# Altium schematic sheet LEDFLASHER_RC.SchDoc
size A; SheetNumber: 1; SheetTotal: 1
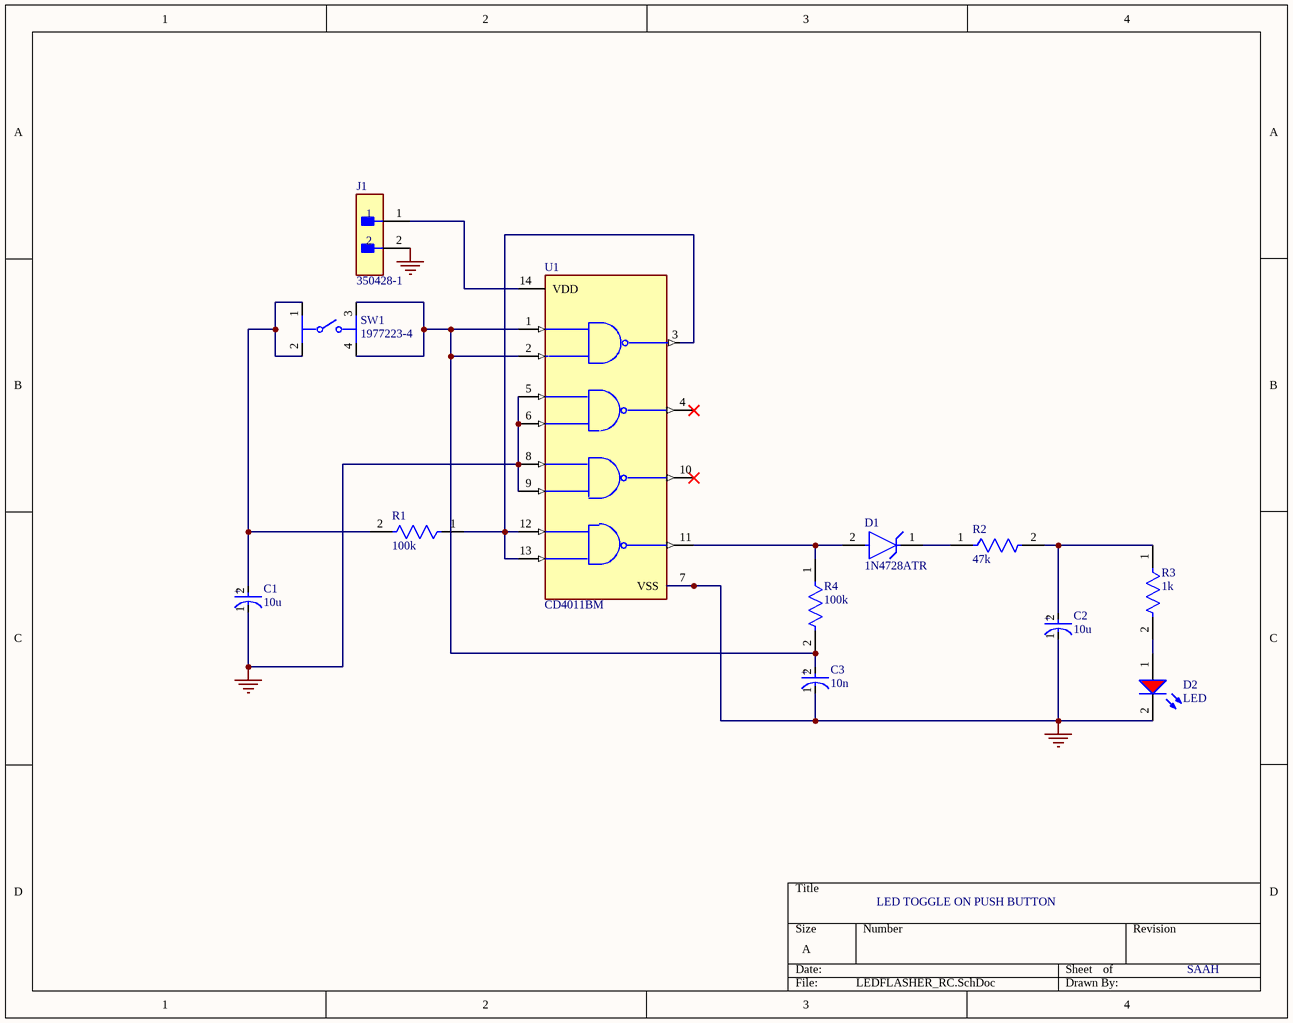
[diagram p0: LEDFLASHER_RC.SchDoc]

## Parts
C1  10u  [FP-RAD-TH-D_12_5_0_5-L_20-MFG]
C2  10u  [FP-RAD-TH-D_10_0_5-L_20_2-MFG]
C3  10n  [FP-RAD-TH-D_12_5_0_5-L_20-MFG]
D1  1N4728ATR  [FP-017AH-MFG]
D2  LED  [WL-TMRC_D5.9H8.7]
J1  350428-1  [FP-350428-1-MFG]
R1  100k  [FP-CF14-MFG]
R2  47k  [FP-CF14-MFG]
R3  1k  [FP-CF14-MFG]
R4  100k  [FP-CF14-MFG]
SW1  1977223-4  [FP-1977223-4-MFG]
U1  CD4011BM  [FP-D0014A-MFG]

## Nets
GND: C1.1(C) C2.1(C) C3.1(C) D2.2(K) J1.2 U1.5(C) U1.6(D) U1.7(VSS) U1.8(E) U1.9(F)
NetC1_2: C1.2(A) R1.2 SW1.1 SW1.2
NetC2_2: C2.2(A) R2.2 R3.1
NetC3_2: C3.2(A) R4.2 SW1.3 SW1.4 U1.1(A) U1.2(B)
NetD1_1: D1.1(C) R2.1
NetD1_2: D1.2(A) R4.1 U1.11(M)
NetD2_1: D2.1(A) R3.2
NetJ1_1: J1.1 U1.14(VDD)
NetR1_1: R1.1 U1.3(J) U1.12(G) U1.13(H)

Not connected (* = marked no-connect by the designer): U1 4(K)* 10(L)*

## Notes on the sheet
- LED TOGGLE ON PUSH BUTTON
- SAAH
- (in symbol CMP-05427-000214-1) +
- (in symbol CMP-05427-000380-1) +

## Library data of the parts
C1 C3 = CMP-05427-000380-1: Aluminum Electrolytic Capacitors (Radial Lead Type) 10uF ±20% 450V; Life (Hours): 10000Hour; Lead Diameter: 0.6mm; Leakage Current: 280uA; Dissipation Factor: 0.24%; Ripple Current: 490mA; Lead Pitch: 5mm; Packaging: Bulk; Min Operating Temperature: -25°C; Package Quantity: 200; Case/Package: Radial; Height - Seated (Max): 0.787inch; Max Operating Temperature: 105°C; Radiation Hardening: No; Lead Free: Lead Free; Series: EE; Capacitance: 10uF; Diameter: 12.5mm; Tolerance: 20%; Termination: Radial; RoHS Compliant: Yes; Voltage Rating: 450V; REACH SVHC: No SVHC; Voltage Rating (DC): 450V; Height: 20mm; Construction: RADIAL; Voltage: 450V; Length: 20mm; Mount: Through Hole
C2 = CMP-05427-000214-1: Aluminum Electrolytic Capacitors (Radial Lead Type) 10uF ±20% 400V; Lead/Base Style: Straight; Lead Diameter: 0.6mm; Dissipation Factor: 0.24%; Ripple Current (AC): 80mA; Life (Hours): 2000Hour; Polarity: Polar; Dielectric Material: Aluminium; Lead Free: Lead Free; Capacitance: 10uF; Tolerance: 20%; Height: 20mm; Number of Pins: 2; Case/Package: Radial; Package Quantity: 200; REACH SVHC: No SVHC; Termination: Radial; Radiation Hardening: No; Diameter: 10mm; RoHS Compliant: Yes; Construction: RADIAL; Max Operating Temperature: 105°C; Voltage Rating: 400V; Mount: Through Hole; Voltage: 400V; Height - Seated (Max): 0.866inch; Lead Pitch: 5mm; Voltage Rating (DC): 400V; Contact Plating: Tin; Length: 20mm; Series: NHG; Min Operating Temperature: -25°C; Packaging: Bulk; Ripple Current: 80mA
D1 = CMP-00278-84408757-1: 1N4728ATR 1N4728 Series 1 W 3.3 V 100 uA Through Hole Zener Diode - DO-41; Manufacturer Lifecycle Status: ACTIVE; Zener Current: 76mA; Peak Reverse Current: 100µA; Power Dissipation: 1W; Element Configuration: Single; Tolerance: 5%; Working Voltage: 3.3V; Material: Glass; Output Current: 330mA; ESD Protection: No; Impedance: 10Ω; Forward Voltage: 1.2V; Radiation Hardening: No; Min Operating Temperature: -65°C; Mount: Through Hole; Number of Pins: 2; Test Current: 76mA; Contact Plating: Tin; Max Reverse Leakage Current: 100µA; Packaging: Cut Tape; RoHS: Compliant; Weight: 245mg; Max Operating Temperature: 200°C; NexarPartId: 84408757; Lifecycle Status: Production; Zener Voltage: 3.3V; REACH SVHC: No SVHC; Lead Free: Lead Free; Max Power Dissipation: 1W; Voltage Rating (DC): 3.3V; Diameter: 2.72mm; Schedule B: 8541100050, 8541100050; Power Rating: 1W; Voltage Tolerance: 5%; Length: 5.2mm
D2 = CMP-03913-71241449-1: 151051SS04000 WL-TMRC THT Mono-color Round Color; Viewing Angle: 40°; Dominant Wavelength: 635nm; Forward Current: 100mA; Forward Voltage: 2.1V; Luminous Intensity: 250mcd; Max Reverse Voltage (DC): 5V; Peak Wavelength: 640nm; Height: 8.6mm; Packaging: Bulk; Mount: Through Hole; Width: 5mm; Min Operating Temperature: -40°C; Wavelength: 635nm; Max Operating Temperature: 85°C; RoHS: Compliant; Length: 5mm; NexarPartId: 71241449
J1 = CMP-03369-000080-1: CONN HEADER VERT 2POS 6.35MM; Manufacturer: TE Connectivity; Standoff Height: 0.63mm; Number Of Contacts: 2; Conn Gender: Male; Voltage Rating: 600V; Conn Orientation: Vertical; Current Rating: 12A; Number Of Rows: 1; Mouser Description: Connector, Soft Shell; Universal MATE-N-LOK; 2; Nylon; Natural; 19 A; 600 VAC; Height: 14.99mm; Pitch: 6.35mm; ComponentLink2URL: https://www.te.com/commerce/DocumentDelivery/DDEController?Action=showdoc&DocId=Customer+Drawing%7F350428%7FY2%7Fpdf%7FEnglish%7FENG_CD_350428_Y2.pdf%7F350428-1; Device Class L1: Connectors; Automotive: No; Octopart: https://octopart.com/350428-1-te+connectivity-46505355; Digikey Description: CONN HEADER VERT 2POS 6.35MM; RoHS: TRUE; Temperature: -40°C to +105°C; Contact Material: Gold,Nickel; Package: 350428-1; Temperature Range Low: -40°C; Device Class L3: unset; Lead Free: Yes; Device Class L2: Headers and Wire Housings; Category: Conn; ComponentLink2Description: Datasheet; Temperature Range High: +105°C; Manufacturer Part Number: 350428-1
R1-R4 = CMP-26528-000003-1: RES 7.5K OHM 1/4W 5% AXIAL; Max Power Dissipation: 250mW; Temperature Coefficient: -400ppm/°C; Resistance: 7.5kR; RoHS Compliant: Yes; Lead Free: Lead Free; Max Operating Temperature: 155°C; Case/Package: Axial; Tolerance: 5%; Power Rating: 250mW; Diameter: 2.3mm; Features: Flame Retardant Coating; Series: CF; Resistor Type: Carbon Film; Number of Terminations: 2; Length: 0.256inch; Min Operating Temperature: -55°C; Contact Plating: Tin; Packaging: Tape and Reel; Mount: Through Hole; Radiation Hardening: No
SW1 = CMP-03407-000020-1: SWITCH TACTILE SPST-NO 0.05A 12V; RoHS Compliant: Yes
U1 = CMP-1627-00066-3: IC GATE NAND 4CH 2-INP 14SOIC; Manufacturer: Texas Instruments; Max Supply Voltage: 18V; Number Of Outputs: 1; Number Of Circuits: 4; Propagation Delay: 45ns; Standoff Height: 0.1mm; Min Supply Voltage: 3V; Quiescent Current: 0.01-0.02uA; Number Of Inputs: 2; Mouser Description: CMOS Quad 2-Input NAND Gate 14-SOIC -55 to 125; Device Class L1: Integrated Circuits (ICs); Automotive: No; Package: D0014A; Temperature Range Low: -55°C; Digikey Description: IC GATE NAND 4CH 2-INP 14SOIC; Ambient Temperature Range High: +125°C; Logic Function Desc: NAND; Device Class L3: Logic Gates; Manufacturer Part Number: CD4011BM; Octopart: https://octopart.com/cd4011bm-texas+instruments-16544; RoHS: TRUE; Height: 1.75mm; Device Class L2: Logic ICs; Ambient Temperature Range Low: -55°C; Temperature: -55°C to +125°C; Lead Free: Yes; ComponentLink2URL: http://www.ti.com/lit/ds/symlink/cd4011b.pdf; Temperature Range High: +125°C; Category: IC; ComponentLink2Description: Datasheet